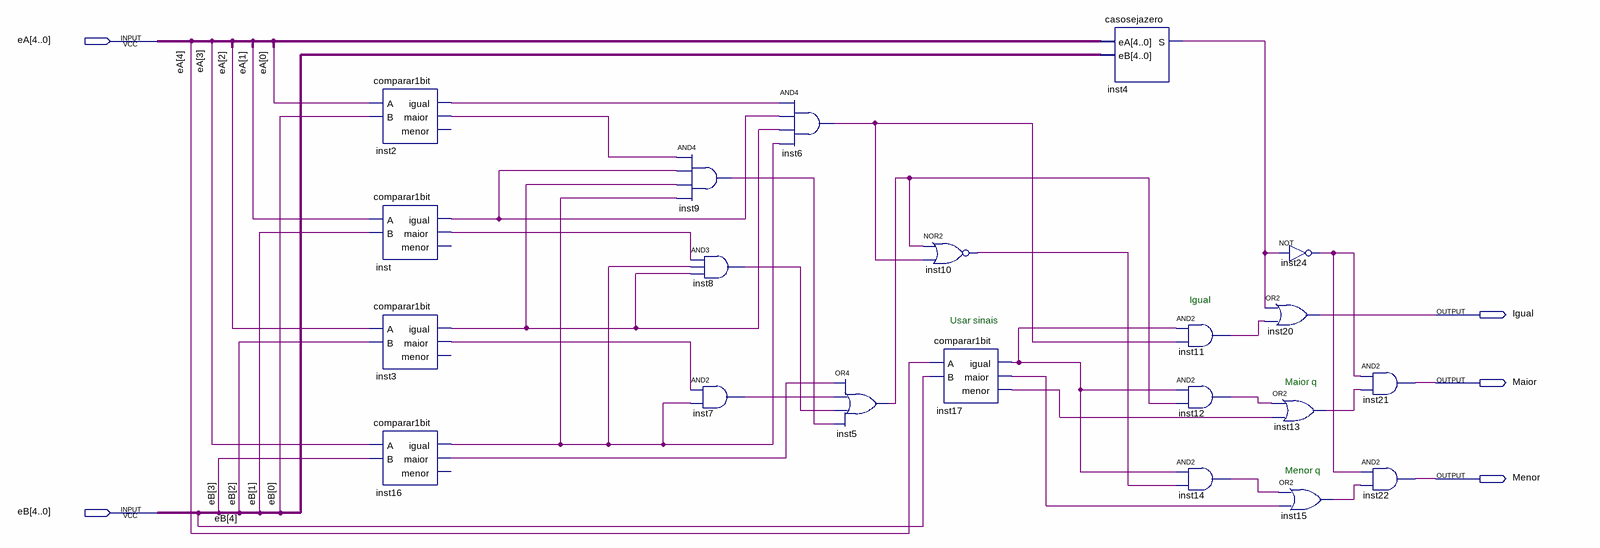
[diagram p0: schematic sheet]
// Quartus schematic comparadorab.bdf as structural Verilog: 21 symbols, 5 pins
module comparadorab (
  input  [4:0] eA,
  input  [4:0] eB,
  output Igual,
  output Maior,
  output Menor
);

  wire inst2_igual, inst2_maior, inst3_igual, inst3_maior, inst4_s, inst5_out, inst6_out, inst7_out,
       inst8_out, inst9_out, inst10_out, inst11_out, inst12_out, inst13_out, inst14_out, inst15_out,
       inst16_igual, inst16_maior, inst17_igual, inst17_maior, inst17_menor, inst24_out, inst_igual,
       inst_maior;

  comparar1bit inst2 (.A(eA[0]), .B(eB[0]), .igual(inst2_igual), .maior(inst2_maior));  // open: menor
  comparar1bit inst (.A(eA[1]), .B(eB[1]), .igual(inst_igual), .maior(inst_maior));  // open: menor
  comparar1bit inst3 (.A(eA[2]), .B(eB[2]), .igual(inst3_igual), .maior(inst3_maior));  // open: menor
  comparar1bit inst16 (.A(eA[3]), .B(eB[3]), .igual(inst16_igual), .maior(inst16_maior));  // open: menor
  and inst9 (inst9_out, inst2_maior, inst_igual, inst3_igual, inst16_igual);
  and inst8 (inst8_out, inst_maior, inst16_igual, inst3_igual);
  and inst7 (inst7_out, inst3_maior, inst16_igual);
  and inst6 (inst6_out, inst2_igual, inst_igual, inst3_igual, inst16_igual);
  or inst5 (inst5_out, inst16_maior, inst7_out, inst8_out, inst9_out);
  nor inst10 (inst10_out, inst5_out, inst6_out);
  comparar1bit inst17 (.A(eA[4]), .B(eB[4]), .igual(inst17_igual), .maior(inst17_maior), .menor(inst17_menor));
  casosejazero inst4 (.eA(eA), .eB(eB), .S(inst4_s));
  and inst11 (inst11_out, inst17_igual, inst6_out);
  and inst12 (inst12_out, inst17_igual, inst5_out);
  and inst14 (inst14_out, inst17_igual, inst10_out);
  not inst24 (inst24_out, inst4_s);
  or inst20 (Igual, inst4_s, inst11_out);
  or inst13 (inst13_out, inst12_out, inst17_menor);
  or inst15 (inst15_out, inst14_out, inst17_maior);
  and inst21 (Maior, inst24_out, inst13_out);
  and inst22 (Menor, inst24_out, inst15_out);

  // Notes on the sheet:
  //   Igual
  //   Usar sinais
  //   Maior q
  //   Menor q
endmodule
